# EAGLE design schema (EAGLE 7.2.0)
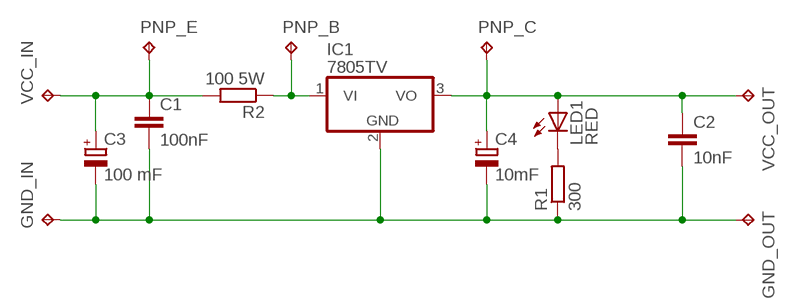
[diagram p0: schematic, sheet 1]

## Parts
C1  100nF  C2.5/4  [C2.5-4]
C2  10nF  C2.5/4  [C2.5-4]
C3  100 mF  CPOL-EUE5-13  [E5-13]
C4  10mF  CPOL-EUE5-13  [E5-13]
GND_IN  TPPAD1-20  [P1-20]
GND_OUT  TPPAD1-20  [P1-20]
IC1  7805TV  [TO220V]
LED1  RED  LED3MM  [LED3MM]
PNP_B  TPPAD1-20Y  [P1-20Y]
PNP_C  TPPAD1-20Y  [P1-20Y]
PNP_E  TPPAD1-20Y  [P1-20Y]
R1  300  R-EU_0204/2V  [0204V]
R2  100 5W  R-EU_0204/7  [0204/7]
VCC_IN  TPPAD1-20  [P1-20]
VCC_OUT  TPPAD1-20  [P1-20]

## Nets
N$1: LED1.K(C) R1.2
N$2: C1.1 C3.+ PNP_E.TP R2.2 VCC_IN.TP
N$3: C1.2 C2.2 C3.- C4.- GND_IN.TP GND_OUT.TP IC1.2(GND) R1.1
N$4: IC1.1(VI) PNP_B.TP R2.1
N$5: C2.1 C4.+ IC1.3(VO) LED1.A PNP_C.TP VCC_OUT.TP

## Library data of the parts
C1 C2 = capacitor-wima:C: CAPACITOR naming: grid - package width
C3 C4 = resistor:CPOL-EU: POLARIZED CAPACITOR, European symbol
GND_IN GND_OUT PNP_B PNP_C PNP_E VCC_IN VCC_OUT = testpad:TP: Test pad
IC1 = linear:78*: Positive VOLTAGE REGULATOR Source: http://cache.national.com/ds/LM/LM78L05.pdf http://www.fairchildsemi.com/ds/LM/LM7805.pdf
LED1 = led:LED: LED OSRAM: - CHIPLED LG R971, LG N971, LY N971, LG Q971, LY Q971, LO R971, LY R971 LH N974, LH R974 LS Q976, LO Q976, LY Q976 LO Q996 - Hyper CHIPLED LW Q18S LB Q993, LB Q99A, LB R99A - SideLED LS A670, LO A670, LY A670, LG A670, LP A670 LB A673, LV A673, LT A673, LW A673 LH A674 LY A675 LS A676, LA A676, LO A676, LY A676, LW A676 LS A679, LY A679, LG A679 - Hyper Micro SIDELED® LS Y876, LA Y876, LO Y876, LY Y876 LT Y87S - SmartLED LW L88C, LW L88S LB L89C, LB L89S, LG L890 LS L89K, LO L89K, LY L89K LS L896, LA L896, LO L896, LY L896 - TOPLED LS T670, LO T670, LY T670, LG T670, LP T670 LSG T670, LSP T670, LSY T670, LOP T670, LYG T670 LG T671, LOG T671, LSG T671 LB T673, LV T673, LT T673, LW T673 LH T674 LS T676, LA T676, LO T676, LY T676, LB T676, LH T676, LSB T676, LW T676 LB T67C, LV T67C, LT T67C, LS T67K, LO T67K, LY T67K, LW E67C LS E67B, LA E67B, LO E67B, LY E67B, LB E67C, LV E67C, LT E67C LW T67C LS T679, LY T679, LG T679 LS T770, LO T770, LY T770, LG T770, LP T770 LB T773, LV T773, LT T773, LW T773 LH T774 LS E675, LA E675, LY E675, LS T675 LS T776, LA T776, LO T776, LY T776, LB T776 LHGB T686 LT T68C, LB T68C - Hyper Mini TOPLED® LB M676 - Mini TOPLED Santana® LG M470 LS M47K, LO M47K, LY M47K Source: http://www.osram.convergy.de LUXEON: - LUMILED® LXK2-PW12-R00, LXK2-PW12-S00, LXK2-PW14-U00, LXK2-PW14-V00 LXK2-PM12-R00, LXK2-PM12-S00, LXK2-PM14-U00 LXK2-PE12-Q00, LXK2-PE12-R00, LXK2-PE12-S00, LXK2-PE14-T00, LXK2-PE14-U00 LXK2-PB12-K00, LXK2-PB12-L00, LXK2-PB12-M00, LXK2-PB14-N00, LXK2-PB14-P00, LXK2-PB14-Q00 LXK2-PR12-L00, LXK2-PR12-M00, LXK2-PR14-Q00, LXK2-PR14-R00 LXK2-PD12-Q00, LXK2-PD12-R00, LXK2-PD12-S00 LXK2-PH12-R00, LXK2-PH12-S00 LXK2-PL12-P00, LXK2-PL12-Q00, LXK2-PL12-R00 Source: www.luxeon.com KINGBRIGHT: KA-3528ASYC Source: www.kingbright.com
R1 R2 = resistor:R-EU_: RESISTOR, European symbol

## Board
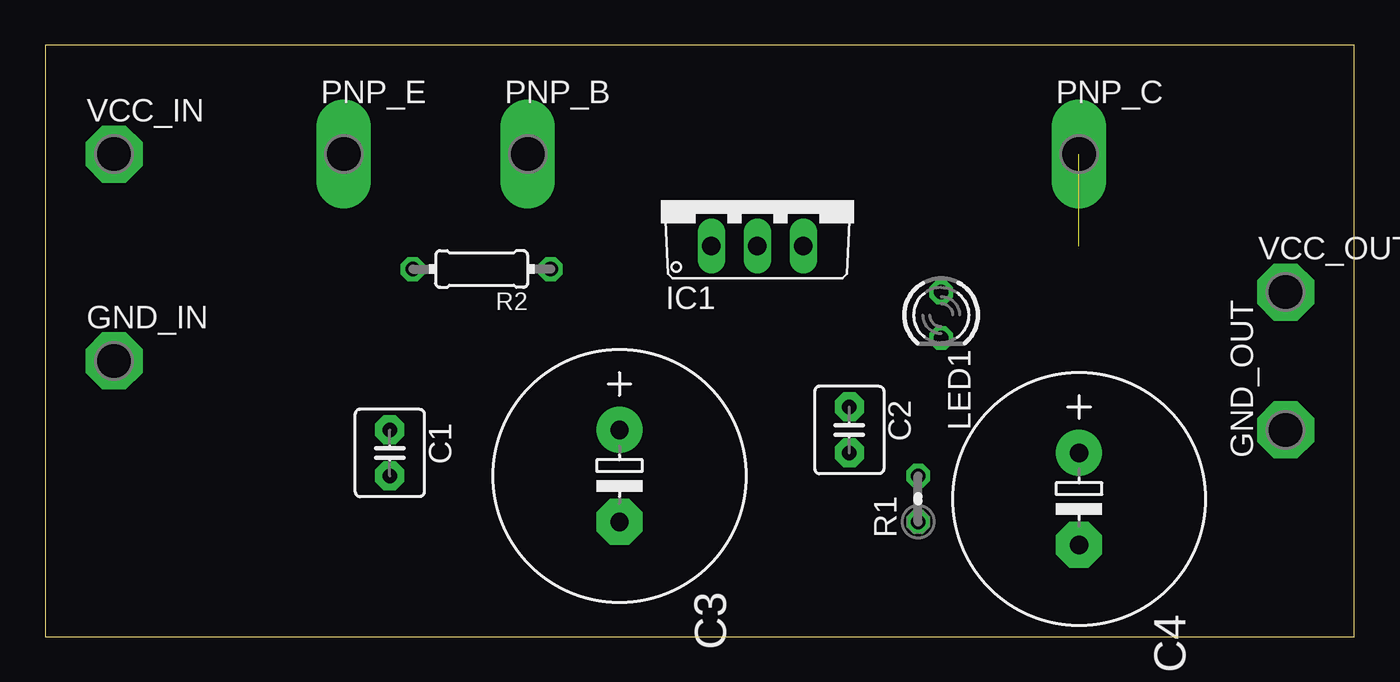
[diagram p1: board, top side]
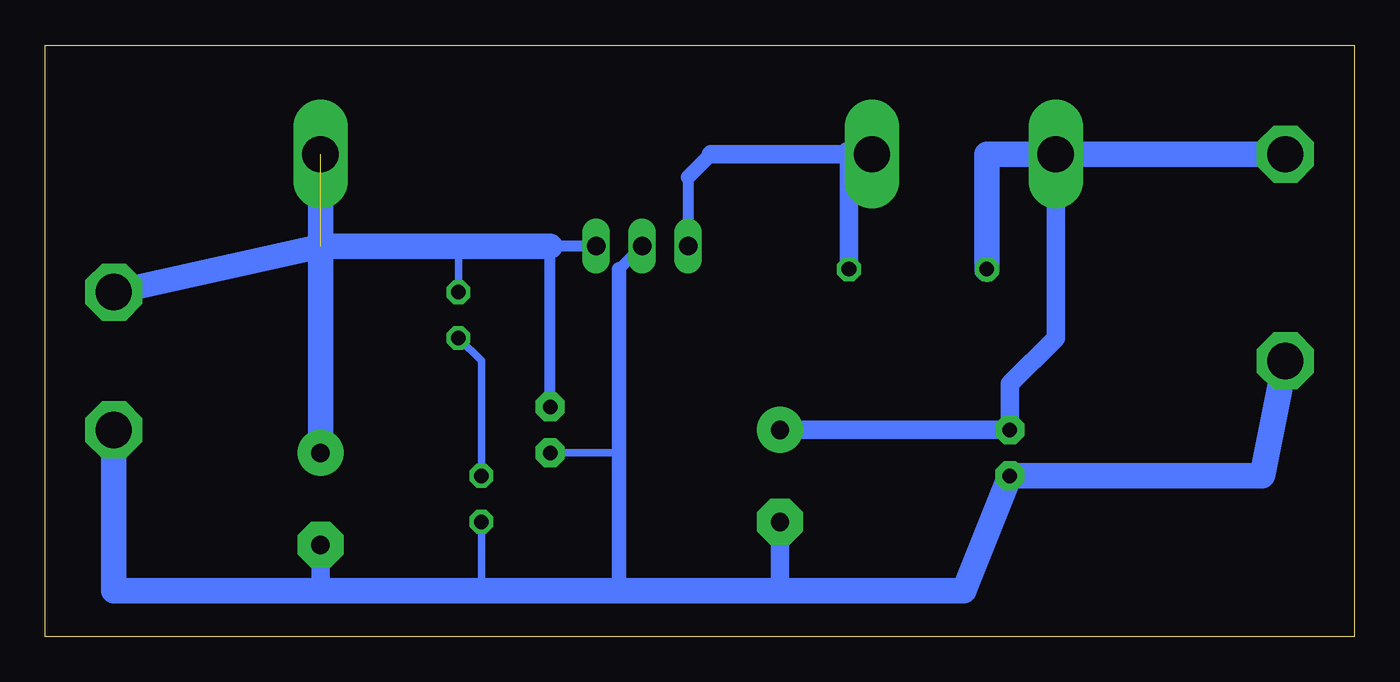
[diagram p2: board, bottom side, seen from below]

Size 72.37 x 32.69 mm. Coordinates in mm from the lower left corner, seen from the top.
Outline: 0,0 72.37,0 72.37,32.69 0,32.69 0,0
Copper layers (1*16): Top 0.035mm / dielectric 1.5mm / Bottom 0.035mm
Design rules "default": minimum track width 10mil, minimum drill 24mil, track to track 8mil, track to pad 8mil, pad to pad 8mil, via to via 8mil, smd to smd 8mil, copper to edge 40mil, drill to drill 8mil, minimum pad ring 10mil, minimum via ring 8mil, stop-mask expansion 4mil, vias tented up to drill 0mil, thermal gap 10mil

### Footprints (pad centres in the part's own frame; a part is rotated, then mirrored left to right if it is on the bottom)
C2.5-4 = drill 0.813 pad 1.6 octagon: 1 -1.27,0; 2 1.27,0
E5-13 = drill 1.016 pad 2.54: + -2.54,0 | drill 1.016 pad 2.54 octagon: - 2.54,0
P1-20 = drill 2.007 pad 3.15 octagon: TP 0,0
TO220V = drill 1.016 long: 1 -2.54,-2.54; 2 0,-2.54; 3 2.54,-2.54
LED3MM = drill 0.813 octagon: A -1.27,0; K 1.27,0
P1-20Y = drill 2.007 pad 2.54 long: TP 0,0
0204V = drill 0.813 octagon: 1 -1.27,0; 2 1.27,0
0204/7 = drill 0.813 octagon: 1 -3.81,0; 2 3.81,0

### Placement (x,y rotation side)
C1  19.05,10.16 270 top
C2  44.45,11.43 270 top
C3  31.75,8.89 270 top
C4  57.15,7.62 270 top
GND_IN  3.81,15.24 0 top
GND_OUT  68.58,11.43 90 top
IC1  39.37,24.13 0 top
LED1  49.53,17.78 270 top
PNP_B  26.67,26.67 0 top
PNP_C  57.15,26.67 0 top
PNP_E  16.51,26.67 0 top
R1  48.26,7.62 90 top
R2  24.13,20.32 180 top
VCC_IN  3.81,26.67 0 top
VCC_OUT  68.58,19.05 0 top

### Tracks (layer width: path | path; a pad name or v marks a point on that pad's centre or on a via)
N$1
  Bottom 0.406: LED1.K 48.26,15.24 R1.2
N$2
  Bottom 1.016: PNP_E.TP 16.51,16.51 19.05,13.97 C1.1 C3.+
  Bottom 1.422: VCC_IN.TP PNP_E.TP 20.32,26.67 R2.2
N$3
  Bottom 0.406: C2.2 40.64,10.16 | 48.26,2.54 R1.1
  Bottom 0.61: IC1.2 40.64,20.32
  Bottom 0.813: 40.64,2.54 40.64,10.16 40.64,20.32
  Bottom 1.016: 31.75,2.54 C3.- | C4.- 57.15,2.54
  Bottom 1.422: GND_IN.TP 5.08,8.89 C1.2 21.59,2.54 31.75,2.54 40.64,2.54 48.26,2.54 57.15,2.54 68.58,2.54 GND_OUT.TP
N$4
  Bottom 0.61: 36.83,25.4 IC1.1
  Bottom 0.813: 35.56,26.67 36.83,25.4
  Bottom 1.016: 35.56,26.67 27.94,26.67 R2.1
  Bottom 1.422: PNP_B.TP 27.94,26.67
N$5  (1 unrouted)
  Bottom 0.406: LED1.A 49.53,21.59 | 57.15,25.4 PNP_C.TP
  Bottom 0.61: IC1.3 44.45,21.59 C2.1
  Bottom 1.422: 44.45,21.59 49.53,21.59 57.15,21.59 | 57.15,21.59 VCC_OUT.TP | C4.+ 57.15,21.59 | 57.15,21.59 57.15,25.4